# Altium schematic sheet Clock.SchDoc
size A4; Organization: Altium Limited; Address1: L3, 12a Rodborough Rd; Address2: Frenchs Forest; Address3: NSW; Address4: Australia 2086
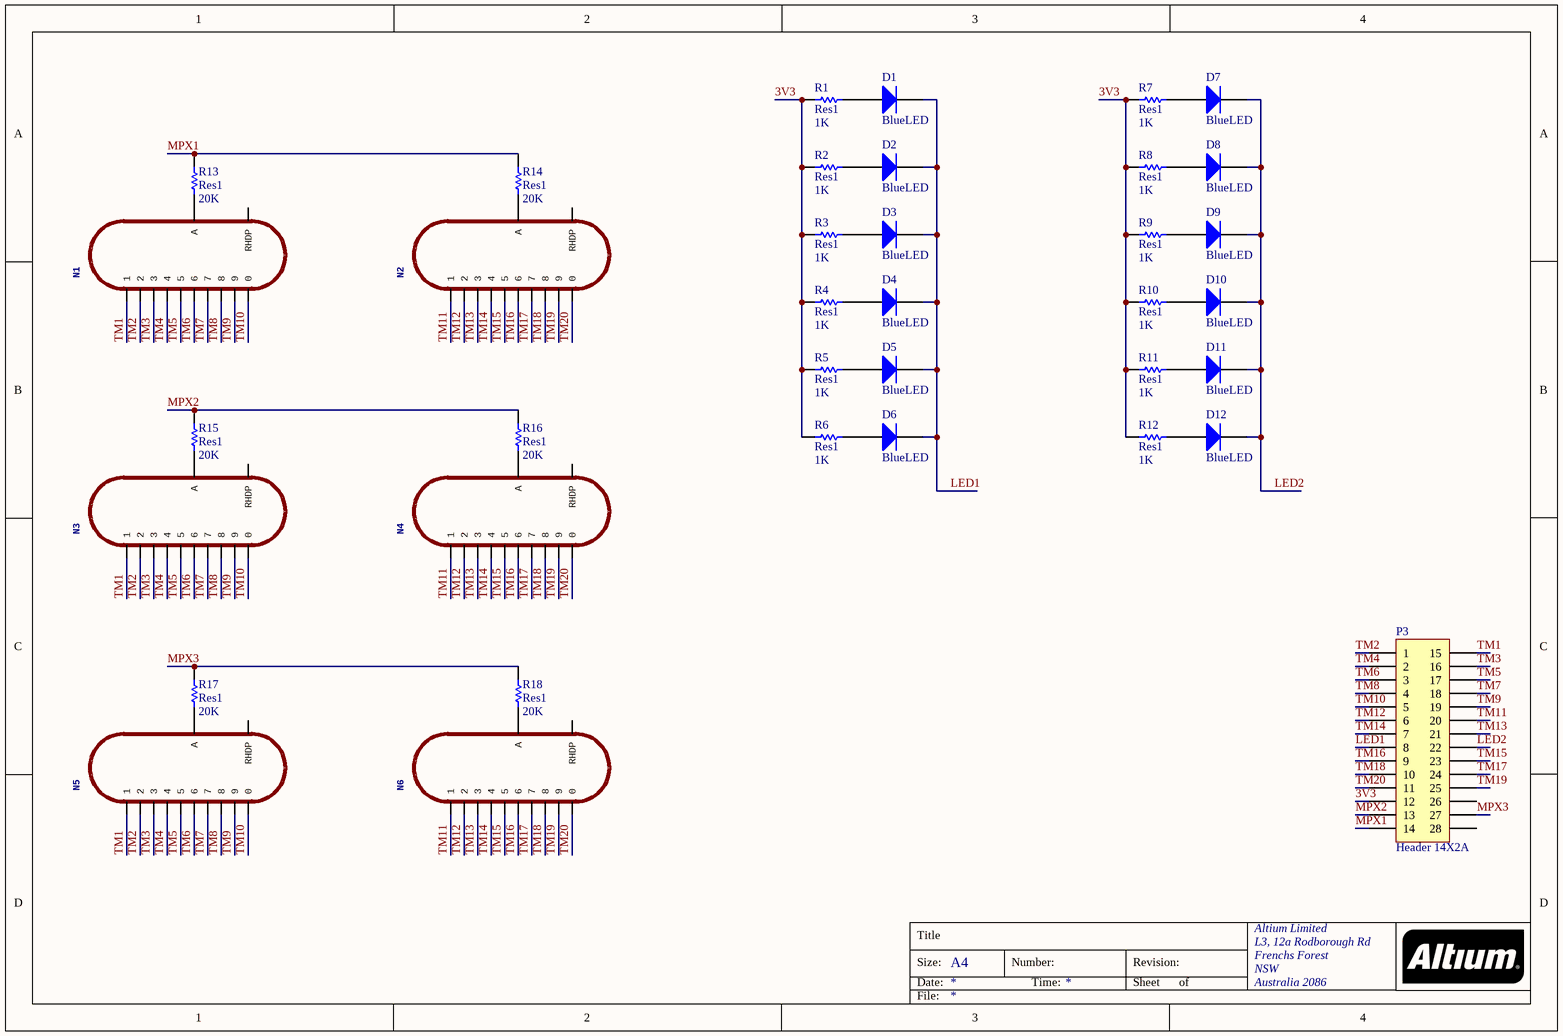
[diagram p0: Clock.SchDoc]

## Parts
D1  BlueLED  [1608[0603]]
D2  BlueLED  [1608[0603]]
D3  BlueLED  [1608[0603]]
D4  BlueLED  [1608[0603]]
D5  BlueLED  [1608[0603]]
D6  BlueLED  [1608[0603]]
D7  BlueLED  [1608[0603]]
D8  BlueLED  [1608[0603]]
D9  BlueLED  [1608[0603]]
D10  BlueLED  [1608[0603]]
D11  BlueLED  [1608[0603]]
D12  BlueLED  [1608[0603]]
N1  IN-8-2: medium numeric frontview nixie tube  [IN-8-2]  (value not drawn)
N2  IN-8-2: medium numeric frontview nixie tube  [IN-8-2]  (value not drawn)
N3  IN-8-2: medium numeric frontview nixie tube  [IN-8-2]  (value not drawn)
N4  IN-8-2: medium numeric frontview nixie tube  [IN-8-2]  (value not drawn)
N5  IN-8-2: medium numeric frontview nixie tube  [IN-8-2]  (value not drawn)
N6  IN-8-2: medium numeric frontview nixie tube  [IN-8-2]  (value not drawn)
P3  Header 14X2A  [HDR2X14_CEN]
R1  Res1  value 1K  [1608[0603]]
R2  Res1  value 1K  [1608[0603]]
R3  Res1  value 1K  [1608[0603]]
R4  Res1  value 1K  [1608[0603]]
R5  Res1  value 1K  [1608[0603]]
R6  Res1  value 1K  [1608[0603]]
R7  Res1  value 1K  [1608[0603]]
R8  Res1  value 1K  [1608[0603]]
R9  Res1  value 1K  [1608[0603]]
R10  Res1  value 1K  [1608[0603]]
R11  Res1  value 1K  [1608[0603]]
R12  Res1  value 1K  [1608[0603]]
R13  Res1  value 20K  [6-0805_M]
R14  Res1  value 20K  [6-0805_M]
R15  Res1  value 20K  [6-0805_M]
R16  Res1  value 20K  [6-0805_M]
R17  Res1  value 20K  [6-0805_M]
R18  Res1  value 20K  [6-0805_M]

## Nets
3V3: P3.12 R1.1 R2.1 R3.1 R4.1 R5.1 R6.1 R7.1 R8.1 R9.1 R10.1 R11.1 R12.1
LED1: D1.2(K) D2.2(K) D3.2(K) D4.2(K) D5.2(K) D6.2(K) P3.8
LED2: D7.2(K) D8.2(K) D9.2(K) D10.2(K) D11.2(K) D12.2(K) P3.22
MPX1: P3.14 R13.2 R14.2
MPX2: P3.13 R15.2 R16.2
MPX3: P3.27 R17.2 R18.2
TM1: N1.1 N3.1 N5.1 P3.15
TM2: N1.2 N3.2 N5.2 P3.1
TM3: N1.3 N3.3 N5.3 P3.16
TM4: N1.4 N3.4 N5.4 P3.2
TM5: N1.5 N3.5 N5.5 P3.17
TM6: N1.6 N3.6 N5.6 P3.3
TM7: N1.7 N3.7 N5.7 P3.18
TM8: N1.8 N3.8 N5.8 P3.4
TM9: N1.9 N3.9 N5.9 P3.19
TM10: N1.0 N3.0 N5.0 P3.5
TM11: N2.1 N4.1 N6.1 P3.20
TM12: N2.2 N4.2 N6.2 P3.6
TM13: N2.3 N4.3 N6.3 P3.21
TM14: N2.4 N4.4 N6.4 P3.7
TM15: N2.5 N4.5 N6.5 P3.23
TM16: N2.6 N4.6 N6.6 P3.9
TM17: N2.7 N4.7 N6.7 P3.24
TM18: N2.8 N4.8 N6.8 P3.10
TM19: N2.9 N4.9 N6.9 P3.25
TM20: N2.0 N4.0 N6.0 P3.11
NetD1_1: D1.1(A) R1.2
NetD2_1: D2.1(A) R2.2
NetD3_1: D3.1(A) R3.2
NetD4_1: D4.1(A) R4.2
NetD5_1: D5.1(A) R5.2
NetD6_1: D6.1(A) R6.2
NetD7_1: D7.1(A) R7.2
NetD8_1: D8.1(A) R8.2
NetD9_1: D9.1(A) R9.2
NetD10_1: D10.1(A) R10.2
NetD11_1: D11.1(A) R11.2
NetD12_1: D12.1(A) R12.2
NetN1_A: N1.A R13.1
NetN2_A: N2.A R14.1
NetN3_A: N3.A R15.1
NetN4_A: N4.A R16.1
NetN5_A: N5.A R17.1
NetN6_A: N6.A R18.1

Not connected (* = marked no-connect by the designer): N1 .(RHDP); N2 .(RHDP); N3 .(RHDP); N4 .(RHDP); N5 .(RHDP); N6 .(RHDP); P3 26 28

## Notes on the sheet
- Title
- Size:
- Date:
- A4
- Number:
- Time:
- Revision:
- Sheet
- of
- File:

## Library data of the parts
D1-D12 = Diode: Default Diode; Published: 8-Jun-2000; LatestRevisionDate: 17-Jul-2002; LatestRevisionNote: Re-released for DXP Platform.; PackageVersion: Sep-1996; PackageReference: SMC; Publisher: Altium Limited; PackageDescription: DO-214-AB/SMC; 2 C-Bend Leads; Body 7.9 x 5.9 mm, inc. leads (LxW); Code_JEDEC: DO-214-AB
N1-N6 = IN-8-2: GateName_1: G$1; SymbolName_1: IN-8-2; LibraryName: nixie-tubes; DeviceSetName: IN-8-2; Package: IN-8-2
P3 = Header 14X2A: Header, 14-Pin, Dual row; System: Connector; LatestRevisionDate: 17-Jul-2002; LatestRevisionNote: Re-released for DXP Platform.; Publisher: Altium Limited
R1-R18 = Res1: Resistor; Published: 8-Jun-2000; LatestRevisionDate: 17-Jul-2002; LatestRevisionNote: Re-released for DXP Platform.; PackageReference: AXIAL-0.3; Publisher: Altium Limited; PackageDescription: Axial Device, Thru-Hole; 2 Leads; 0.3 in Pin Spacing